# EasyEDA Pro project easy_eda_pro_file.epro

# Schematic Schematic1
Create Date: 2024-04-02; Page Name: P1; Project Name: modula_2024; Schematic Name: Schematic1; Update Date: 2024-04-03; Company: EasyEDA.com; Drawn: EasyEDA; Page Size: A4; Part Number: JLCPCB-002; Reviewed: EasyEDA; Version: V0.1
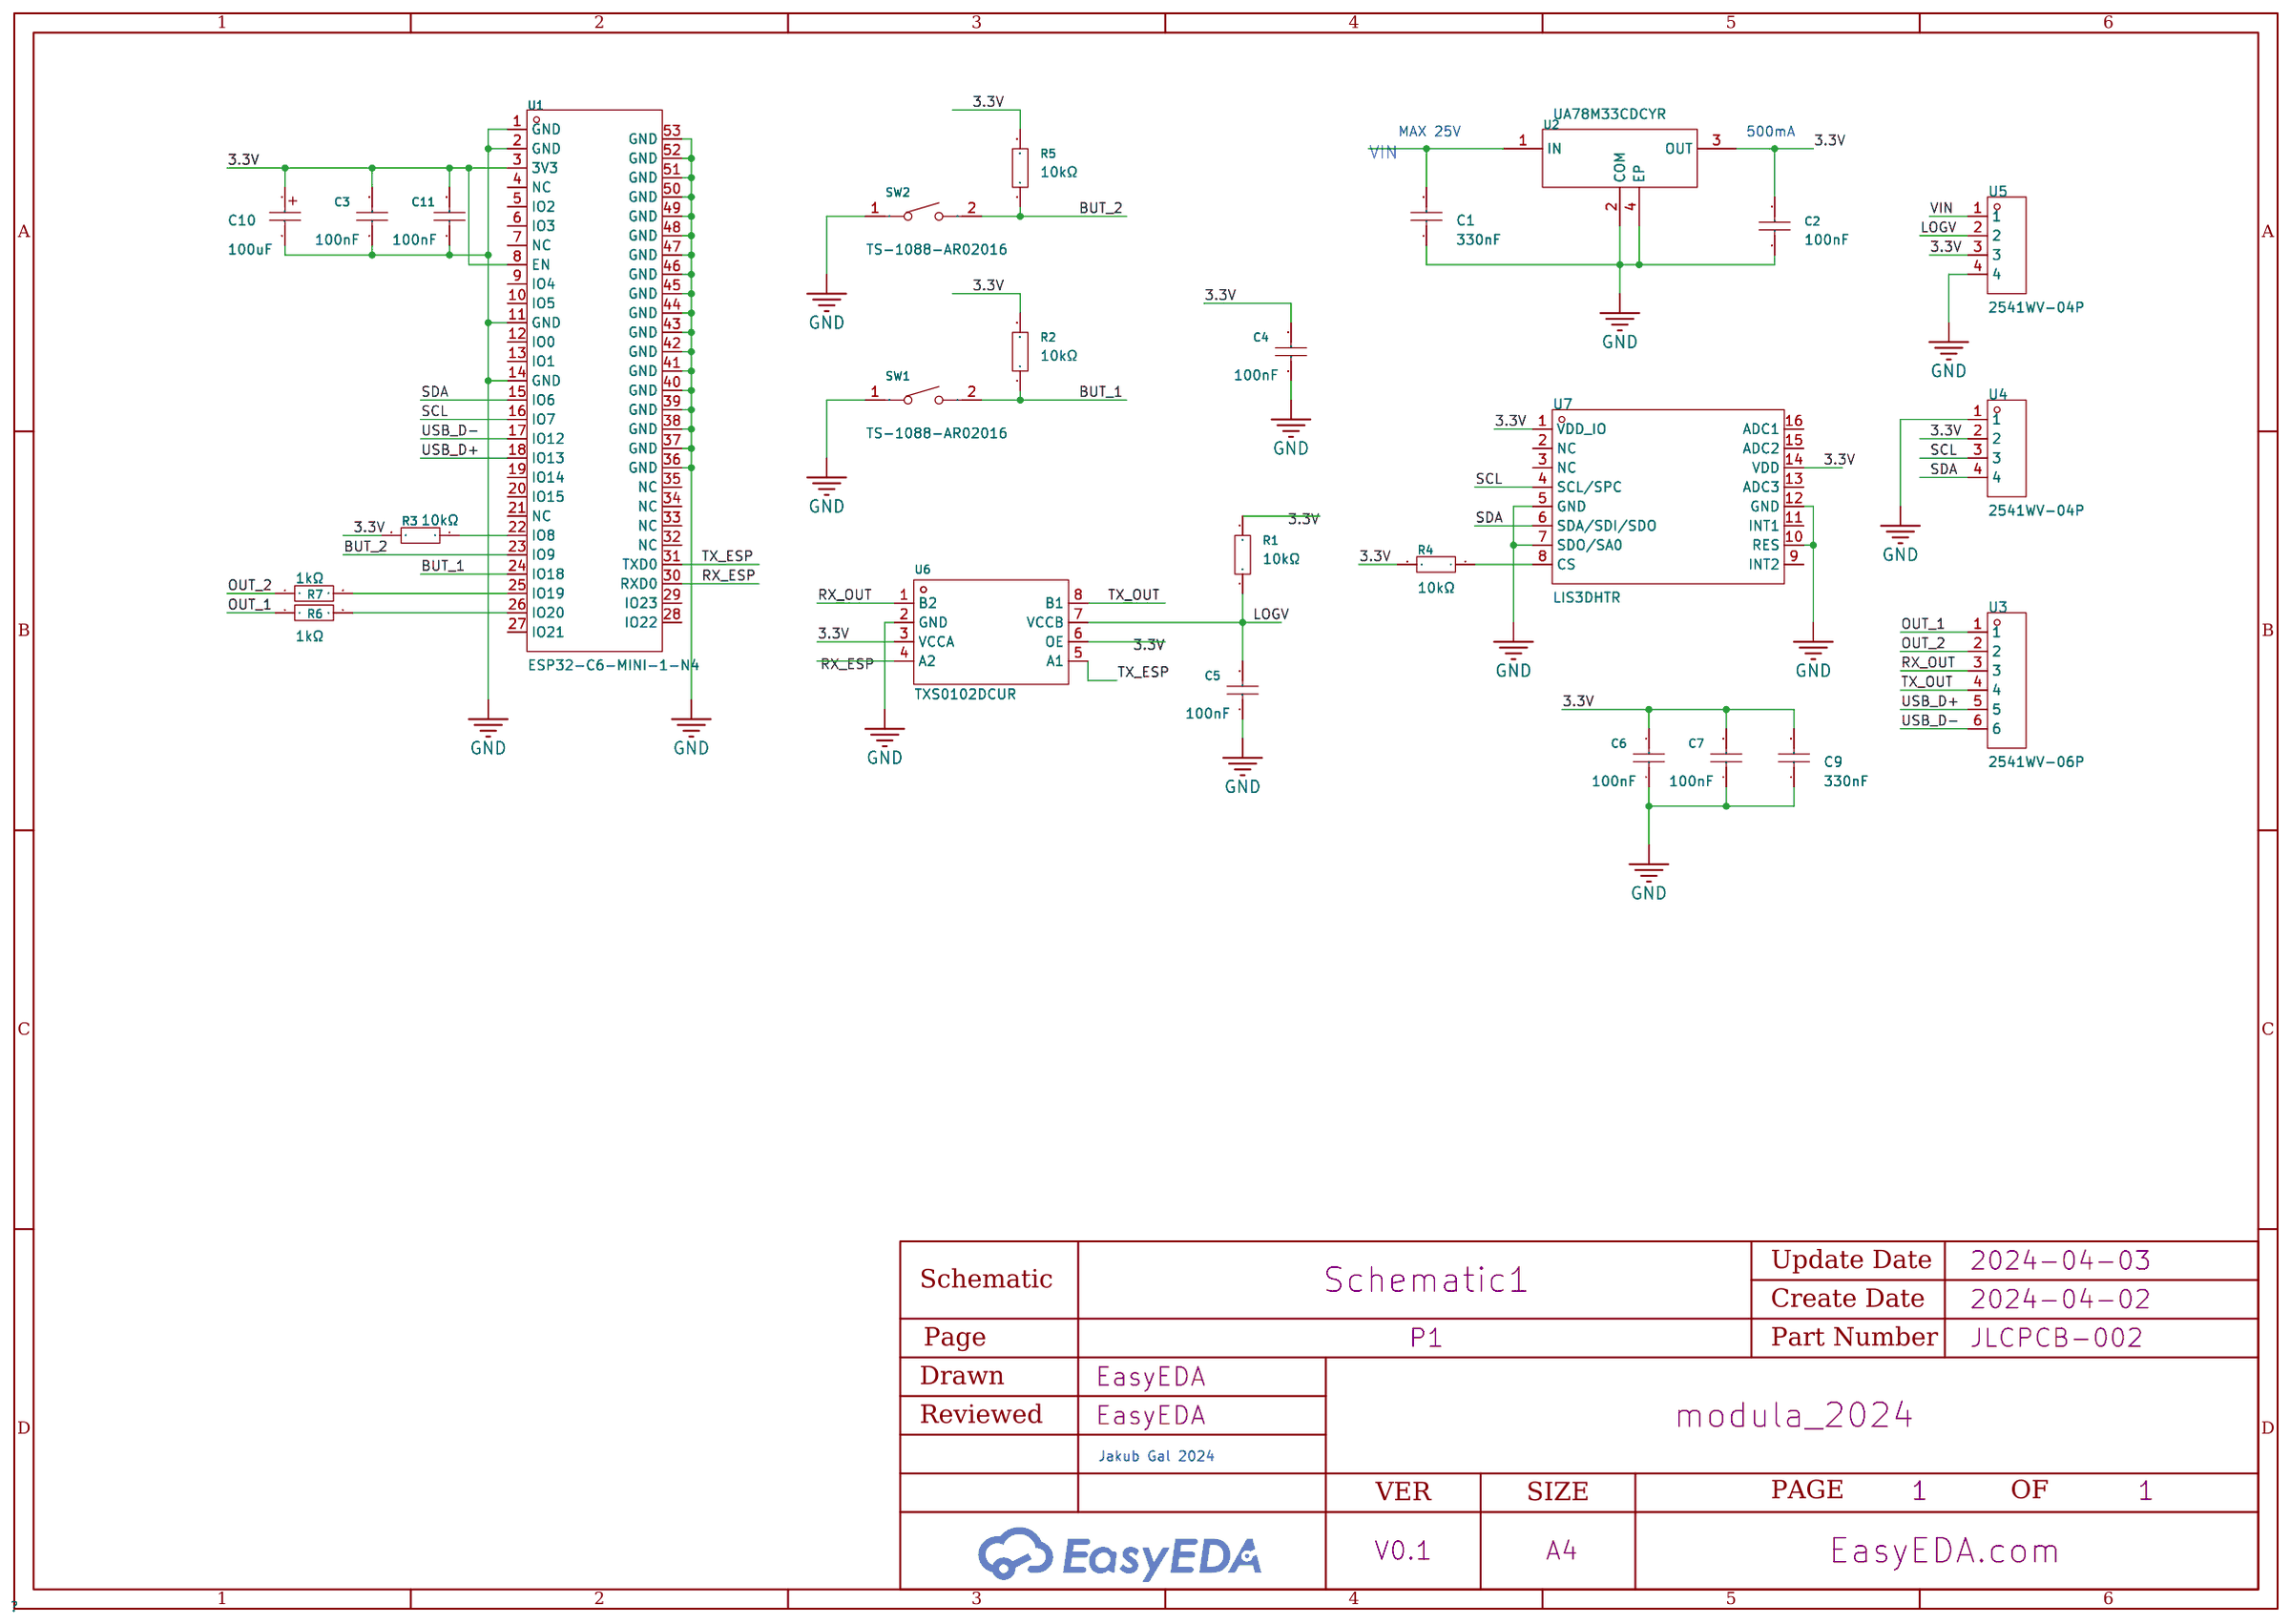
[diagram p0: schematic sheet]

## Parts
C1  330nF  [C0805]
C2  100nF  [C0603]
C3  100nF  [C0603]
C4  100nF  [C0603]
C5  100nF  [C0603]
C6  100nF  [C0603]
C7  100nF  [C0603]
C9  330nF  [C0805]
C10  100uF  [CAP-SMD_L3.5-W2.8-R-RD]
C11  100nF  [C0603]
R1  10kΩ  [R0603]
R2  10kΩ  [R0603]
R3  10kΩ  [R0603]
R4  10kΩ  [R0603]
R5  10kΩ  [R0603]
R6  1kΩ  [R0603]
R7  1kΩ  [R0603]
SW1  TS-1088-AR02016  [SW-SMD_L3.9-W3.0-P4.45]
SW2  TS-1088-AR02016  [SW-SMD_L3.9-W3.0-P4.45]
U1  ESP32-C6-MINI-1-N4  [WIFIM-SMD_61P-L16.6-W13.2-P0.80-ESP32-C6-MINI-1-N4]
U2  UA78M33CDCYR  [SOT-223_L6.5-W3.5-P2.30-LS7.0-BR]
U3  2541WV-06P  [HDR-TH_6P-P2.54-V-M]
U4  2541WV-04P  [HDR-TH_4P-P2.54-V-M-1]
U5  2541WV-04P  [HDR-TH_4P-P2.54-V-M-1]
U6  TXS0102DCUR  [VSON8_L2.0-W2.3-P0.50-LS3.1-BL]
U7  LIS3DHTR  [LGA-16_L3.0-W3.0-P0.50-TL]

## Library data of the parts
C1 C9 = 0805B334K500NT: Capacitance:330nF Tolerance:±10% Tolerance:±10% Voltage Rated: Temperature Coefficient:; LCSC Part Name: 330nF ±10% 50V; Supplier Part: C1740; Manufacturer: FH(风华); Supplier Footprint: 0805; JLCPCB Part Class: Extended Part; Datasheet: https://atta.szlcsc.com/upload/public/pdf/source/20200305/C486355_26A10D38EF8C2A5C37091D0039909270.pdf; Supplier: LCSC; Tolerance: ±10%
C2-C7 C11 = 0603B104K500NT_C30926: Capacitance:100nF Tolerance:±10% Tolerance:±10% Voltage Rated: Temperature Coefficient:; LCSC Part Name: 100nF ±10% 50V; Supplier Part: C30926; Manufacturer: FH(风华); Manufacturer Part: 0603B104K500NT; Supplier Footprint: 0603; JLCPCB Part Class: Extended Part; Datasheet: https://atta.szlcsc.com/upload/public/pdf/source/20200305/C486355_26A10D38EF8C2A5C37091D0039909270.pdf; Supplier: LCSC; Tolerance: ±10%
C10 = CA45-B-6.3V-100uF-K: Capacitance: Tolerance:±10% Tolerance:±10% Rated Voltage: Equivalent Series Resistance(ESR):5Ω@100kHz Operating Temperature:-55℃~+125℃ Operating Temperature:-55℃~+125℃; LCSC Part Name: 100uF ±10% 6.3V; Supplier Part: C129289; Manufacturer: CEC(振华新云); Supplier Footprint: CASE-B-3528; JLCPCB Part Class: Extended Part; Datasheet: https://atta.szlcsc.com/upload/public/pdf/source/20170914/C129289_1505359937328968145.pdf; Supplier: LCSC; Tolerance: ±10%; Equivalent Series Resistance(ESR): 5Ω@100kHz; Operating Temperature: -55℃~+125℃
R1-R5 = 0603WAF1002T5E: Type:Thick Film Resistors Resistance:10kΩ Tolerance:±1% Tolerance:±1% Power(Watts): Overload Voltage (Max): Temperature Coefficient:±100ppm/℃ Temperature Coefficient:±100ppm/℃ Operating Temperature Range:-55℃~+155℃ Operating Temperature Range:-55℃~+155℃; LCSC Part Name: 厚膜电阻 10kΩ ±1% 100mW; Supplier Part: C25804; Manufacturer: UNI-ROYAL(厚声); Supplier Footprint: 0603; JLCPCB Part Class: Basic Part; Datasheet: https://atta.szlcsc.com/upload/public/pdf/source/20200306/C422600_1E6D84923E4A46A82E41ADD87F860B5C.pdf; Supplier: LCSC; Type: Thick Film Resistors; Tolerance: ±1%; Temperature Coefficient: ±100ppm/℃; Operating Temperature Range: -55℃~+155℃
R6 R7 = 0603WAJ0102T5E: Type:Thick Film Resistors Resistance:1kΩ Tolerance:±5% Tolerance:±5% Power(Watts): Overload Voltage (Max): Temperature Coefficient:±100ppm/℃ Temperature Coefficient:±100ppm/℃ Operating Temperature Range:-55℃~+155℃ Operating Temperature Range:-55℃~+155℃; LCSC Part Name: 1kΩ ±5% 100mW 厚膜电阻; Supplier Part: C25585; Manufacturer: UNI-ROYAL(厚声); Supplier Footprint: 0603; JLCPCB Part Class: Extended Part; Datasheet: https://atta.szlcsc.com/upload/public/pdf/source/20200306/C422600_1E6D84923E4A46A82E41ADD87F860B5C.pdf; Supplier: LCSC; Type: Thick Film Resistors; Tolerance: ±5%; Temperature Coefficient: ±100ppm/℃; Operating Temperature Range: -55℃~+155℃
SW1 SW2 = TS-1088-AR02016: Circuit:SPST Actuator Style:Round Button Operating Force:160gf Mounting Style:Brick nogging Switch Length:4mm Switch Width:3mm Switch Height:2mm Strike Gundam:不带 Contact Current:50mA Voltage Rating (DC):12V Insulation Resistance:100MΩ Actuator/Cap Color:B; LCSC Part Name: 4*3*2mm 立贴 轻触开关; Supplier Part: C720477; Manufacturer: XUNPU(讯普); Supplier Footprint: SMD; JLCPCB Part Class: Extended Part; Datasheet: https://atta.szlcsc.com/upload/public/pdf/source/20200810/C720475_60D09DD6C54279ADDB2DC25100F1CC11.pdf; Supplier: LCSC; Circuit: SPST; Actuator Style: Round Button; Operating Force: 160gf; Mounting Style: Brick nogging; Switch Length: 4mm; Switch Width: 3mm; Switch Height: 2mm; Strike Gundam: 不带; Contact Current: 50mA; Voltage Rating (DC): 12V; Insulation Resistance: 100MΩ; Actuator/Cap Color: Black; Pin Style: SMDSplicing; Mechanical Life: 10万次; Operating Temperature: -30℃~+80℃
U1 = ESP32-C6-MINI-1-N4: Supplier Part: C5736265; Manufacturer: ESPRESSIF(乐鑫); Supplier Footprint: SMD-53P; JLCPCB Part Class: Extended Part; Datasheet: https://atta.szlcsc.com/upload/public/pdf/source/20240130/4529D418EFEC832950EB8101798FAED6.pdf; Supplier: LCSC
U2 = UA78M33CDCYR: Output Type: Maximum Input Voltage:25V Output Voltage:3.3V Output Voltage:3.3V MAX Output Current:500mA Power Supply Rejection Ratio (PSRR):80dB@(120Hz) Dropout Voltage:2V@(350mA) Operating Temperature:0℃~+125℃ Operating Temperature:0℃~+125℃ Output Polari; LCSC Part Name: 输入25V 输出3.3V 500mA; Supplier Part: C49036; Manufacturer: TI(德州仪器); Supplier Footprint: SOT-223; JLCPCB Part Class: Extended Part; Datasheet: https://www.ti.com/cn/lit/gpn/ua78m; Supplier: LCSC; Maximum Input Voltage: 25V; Output Voltage: 3.3V; MAX Output Current: 500mA; Power Supply Rejection Ratio (PSRR): 80dB@(120Hz); Dropout Voltage: 2V@(350mA); Operating Temperature: 0℃~+125℃; Output Polarity: Positive electrode; Number of Outputs: 1
U3 = 2541WV-06P: Pitch:2.54mm Mounting Type:Straight Number of Rows:Plugin Length of Mating Pin:6mm Insulation Height:2.54mm Length of End Connection Pin:3mm; Supplier Part: C5383115; Manufacturer: HanElectricity(瀚源); Supplier Footprint: 插件,P=2.54mm; JLCPCB Part Class: Extended Part; Datasheet: https://atta.szlcsc.com/upload/public/pdf/source/20230330/2BC52F76E32B2D45ECCE68ADA82449DD.pdf; Supplier: LCSC; Pitch: 2.54mm; Mounting Type: Straight; Number of Rows: Plugin; Length of Mating Pin: 6mm; Insulation Height: 2.54mm; Length of End Connection Pin: 3mm
U4 U5 = 2541WV-04P: Pitch:2.54mm Mounting Type:Straight Number of Rows:Plugin Length of Mating Pin:6mm Insulation Height:2.54mm Length of End Connection Pin:3mm; Supplier Part: C5383113; Manufacturer: HanElectricity(瀚源); Supplier Footprint: 插件,P=2.54mm; Datasheet: https://atta.szlcsc.com/upload/public/pdf/source/20230330/2BC52F76E32B2D45ECCE68ADA82449DD.pdf; Supplier: LCSC; Pitch: 2.54mm; Mounting Type: Straight; Number of Rows: Plugin; Length of Mating Pin: 6mm; Insulation Height: 2.54mm; Length of End Connection Pin: 3mm
U6 = TXS0102DCUR: Channel Type:Bi-Directional Input Signal:- Output Signal:- Data Rate:24Mbps Supply Voltage (VCCA):1.65V~3.6V Supply Voltage (VCCA):1.65V~3.6V Supply Voltage (VCCB):2.3V~5.5V Supply Voltage (VCCB):2.3V~5.5V Number of Circuits:1 Channels per Circuit:2 Outpu; LCSC Part Name: 24Mbps 2位双向电平转换器; Supplier Part: C53434; Manufacturer: TI(德州仪器); Supplier Footprint: VSSOP-8; JLCPCB Part Class: Extended Part; Datasheet: https://www.ti.com/cn/lit/gpn/txs0102; Supplier: LCSC; Channel Type: Bi-Directional; Data Rate: 24Mbps; Supply Voltage (VCCA): 1.65V~3.6V; Supply Voltage (VCCB): 2.3V~5.5V; Number of Circuits: 1; Channels per Circuit: 2; Output Type: Open Drain；Push-pull; Operating Temperature: -40℃~+85℃; Features: 自动方向检测
U7 = LIS3DHTR: Axial Direction:X,Y,Z Supply Voltage:1.71V~3.6V Supply Voltage:1.71V~3.6V Operating Temperature:-40℃~+85℃ Operating Temperature:-40℃~+85℃; Supplier Part: C15134; Manufacturer: ST(意法半导体); Supplier Footprint: LGA-16(3x3); JLCPCB Part Class: Extended Part; Datasheet: https://atta.szlcsc.com/upload/public/pdf/source/20170502/1493709336456.pdf; Supplier: LCSC; Axial Direction: X,Y,Z; Supply Voltage: 1.71V~3.6V; Operating Temperature: -40℃~+85℃

## Nets
3.3V: C2.2 C3.2 C4.2 C6.2 C7.2 C9.2 C10.1 C11.2 R1.2 R2.2 R3.2 R4.2 R5.2 U1.3(3V3) U1.8(EN) U2.3(OUT) U4.2 U5.3 U6.3(VCCA) U6.6(OE) U7.1(VDD_IO) U7.14(VDD)
GND: C1.1 C2.1 C3.1 C4.1 C5.1 C6.1 C7.1 C9.1 C10.2 C11.1 SW1.1 SW2.1 U1.1(GND) U1.2(GND) U1.11(GND) U1.14(GND) U1.36(GND) U1.37(GND) U1.38(GND) U1.39(GND) U1.40(GND) U1.41(GND) U1.42(GND) U1.43(GND) U1.44(GND) U1.45(GND) U1.46(GND) U1.47(GND) U1.48(GND) U1.49(GND) U1.50(GND) U1.51(GND) U1.52(GND) U1.53(GND) U2.2(COM) U2.4(EP) U4.1 U5.4 U6.2(GND) U7.5(GND) U7.7(SDO/SA0) U7.10(RES) U7.12(GND)
VIN: C1.2 U2.1(IN) U5.1
BUT_1: R2.1 SW1.2 U1.24(IO18)
BUT_2: R5.1 SW2.2 U1.23(IO9)
LOGV: C5.2 R1.1 U5.2 U6.7(VCCB)
OUT_1: R6.1 U3.1
OUT_2: R7.1 U3.2
RX_ESP: U1.30(RXD0) U6.4(A2)
RX_OUT: U3.3 U6.1(B2)
SCL: U1.16(IO7) U4.3 U7.4(SCL/SPC)
SDA: U1.15(IO6) U4.4 U7.6(SDA/SDI/SDO)
TX_ESP: U1.31(TXD0) U6.5(A1)
TX_OUT: U3.4 U6.8(B1)
USB_D+: U1.18(IO13) U3.5
USB_D-: U1.17(IO12) U3.6
$1N2460: R3.1 U1.22(IO8)
$1N2771: R4.1 U7.8(CS)
$1N3900: R7.2 U1.25(IO19)
$1N4216: R6.2 U1.26(IO20)

Not connected (* = marked no-connect by the designer): U1 4(NC) 5(IO2) 6(IO3) 7(NC) 9(IO4) 10(IO5) 12(IO0) 13(IO1) 19(IO14) 20(IO15) 21(NC) 27(IO21) 28(IO22) 29(IO23) 32(NC) 33(NC) 34(NC) 35(NC); U7 2(NC) 3(NC) 9(INT2) 11(INT1) 13(ADC3) 15(ADC2) 16(ADC1)

## Notes on the sheet
- MAX 25V
- 500mA
- Jakub Gal 2024

# Board PCB1
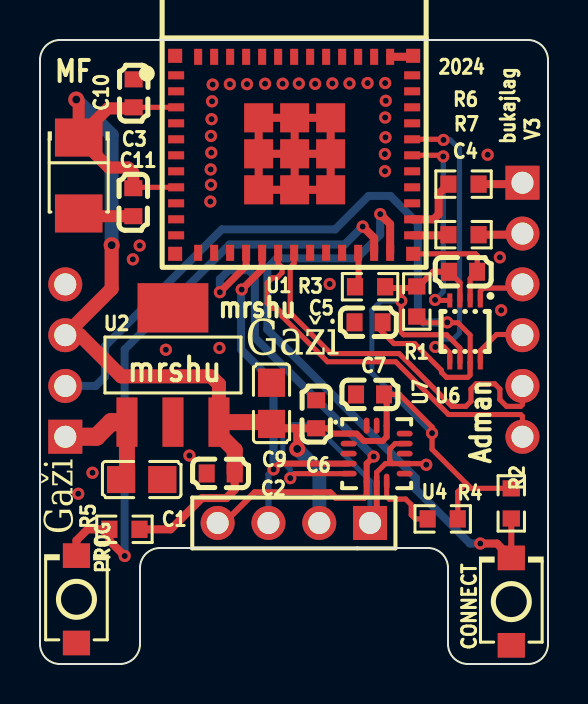
[diagram p1: board, top side]
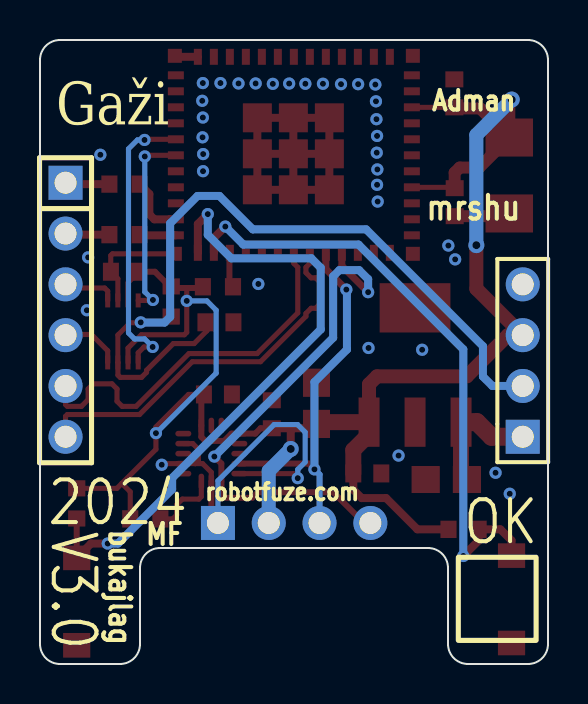
[diagram p2: board, bottom side, seen from below]

Outline 25.4 x 31.2 mm; copper layers: Top Layer, Bottom Layer. Coordinates in mm from the lower left corner of the outline.
Outline path: 0,30.2 0,1 arc(0.29,0.29) 1,0 4,0 arc(4.71,0.29) 5,1 5,4.8 arc(5.29,5.51) 6,5.8 19.4,5.8 arc(20.11,5.51) 20.4,4.8 20.4,1 arc(20.69,0.29) 21.4,0 24.4,0 arc(25.11,0.29) 25.4,1 25.4,30.2 arc(25.11,30.91) 24.4,31.2 1,31.2 arc(0.29,30.91) 0,30.2
Stack: Top Layer 0.035mm / Dielectric1 1.51mm FR4 er 4.5 / Bottom Layer 0.035mm

## Design rules (mm)
net USB_D-: DP1
net USB_D+: DP1
template: JLCPCB Capability(Two Layers Board)
spacing copperThickness1oz (default): track to track 0.102, other pairs 0.152 to 0.3
spacing copperThickness2oz: track to track 0.203, other pairs 0.152 to 0.3
track width copperThickness1oz (default): min 0.127, default 0.254, max 2.54
track width copperThickness2oz: min 0.203, default 0.254, max 2.54
differential pair differentialPair (default): width min 0.127, default 0.254, max 2.54; gap min 0.152, default 0.152
via viaSize (default): diameter min 0.5, default 0.61, max 10; hole min 0.3, default 0.305, max 6.3

## Placement (name value [footprint] x y rotation side)
C1  330nF  [C0805]  5.09 9.22 180 top
C2  100nF  [C0603]  9.04 9.53 0 top
C3  100nF  [C0603]  4.68 28.53 270 top
C4  100nF  [C0603]  21.15 19.61 180 top
C5  100nF  [C0603]  16.43 17.08 0 top
C6  100nF  [C0603]  13.81 12.49 270 top
C7  100nF  [C0603]  16.5 13.48 0 top
C9  330nF  [C0805]  11.58 13.03 270 top
C10  100uF  [CAP-SMD_L3.5-W2.8-R-RD]  1.94 24.43 90 top
C11  100nF  [C0603]  4.67 23.09 90 top
CONNECT  TS-1088-AR02016  [SW-SMD_L3.9-W3.0-P4.45]  23.57 3.12 90 top
PROG  TS-1088-AR02016  [SW-SMD_L3.9-W3.0-P4.45]  1.82 3.23 90 top
R1  10kΩ  [R0603]  18.84 18.13 90 top
R2  10kΩ  [R0603]  23.56 8.03 90 top
R3  10kΩ  [R0603]  16.5 18.86 0 top
R4  10kΩ  [R0603]  20.14 7.25 0 top
R5  10kΩ  [R0603]  4.22 6.73 0 top
R6  1kΩ  [R0603]  21.18 23.99 180 top
R7  1kΩ  [R0603]  21.18 21.47 180 top
U1  ESP32-C6-MINI-1-N4  [WIFIM-SMD_61P-L16.6-W13.2-P0.80-ESP32-C6-MINI-1-N4]  12.71 25.46 0 top
U2  UA78M33CDCYR  [SOT-223_L6.5-W3.5-P2.30-LS7.0-BR]  6.65 14.95 270 top
U3  2541WV-06P  [HDR-TH_6P-P2.54-V-M]  24.12 17.71 270 bottom
U4  2541WV-04P  [HDR-TH_4P-P2.54-V-M-1]  12.69 7.05 180 top
U5  2541WV-04P  [HDR-TH_4P-P2.54-V-M-1]  1.26 15.17 90 bottom
U6  TXS0102DCUR  [VSON8_L2.0-W2.3-P0.50-LS3.1-BL]  21.25 16.63 180 top
U7  LIS3DHTR  [LGA-16_L3.0-W3.0-P0.50-TL]  16.83 10.52 0 top

## Footprints (pads in the part's own frame, mm; a bottom-side part is the same pattern mirrored in y, then rotated)
C0603
  rect 0.8x0.9 smd: 1(-0.7,0) 2(0.7,0)
C0805
  rect 1.41x1.35 smd: 1(-1.03,0) 2(1.03,0)
CAP-SMD_L3.5-W2.8-R-RD
  rect 1.9x2.376 smd: 1(1.899,0) 2(-1.899,0)
HDR-TH_4P-P2.54-V-M-1
  rect 1.7x1.7 hole 1.1: 1(-3.81,0)
  round 1.7 hole 1.1: 2(-1.27,0) 3(1.27,0) 4(3.81,0)
HDR-TH_6P-P2.54-V-M
  rect 1.7x1.7 hole 1.1: 1(-6.35,0)
  round 1.7 hole 1.1: 2(-3.81,0) 3(-1.27,0) 4(1.27,0) 5(3.81,0) 6(6.35,0)
LGA-16_L3.0-W3.0-P0.50-TL
  oval 0.8x0.28 smd: 1(-1.4,1) 2(-1.4,0.5) 3(-1.4,0) 4(-1.4,-0.5) 5(-1.4,-1) 9(1.4,-1) 10(1.4,-0.5) 11(1.4,0) 12(1.4,0.5) 13(1.4,1)
  oval 0.28x0.8 smd: 6(-0.5,-1.4) 7(0,-1.4) 8(0.5,-1.4) 14(0.5,1.4) 15(0,1.4) 16(-0.5,1.4)
R0603
  rect 0.806x0.864 smd: 1(-0.753,0) 2(0.753,0)
SOT-223_L6.5-W3.5-P2.30-LS7.0-BR
  rect 2.465x1.05 smd: 1(2.857,-2.3) 2(2.857,0) 3(2.857,2.3)
  rect 2.465x3.54 smd: 4(-2.857,0)
SW-SMD_L3.9-W3.0-P4.45
  rect 1.23x1.36 smd: 1(-2.185,0) 2(2.185,0)
VSON8_L2.0-W2.3-P0.50-LS3.1-BL
  rect 0.25x0.7 smd: 1(-0.762,-1.55) 2(-0.254,-1.55) 3(0.254,-1.55) 4(0.762,-1.55) 5(0.762,1.55) 6(0.254,1.55) 7(-0.254,1.55) 8(-0.762,1.55)
WIFIM-SMD_61P-L16.6-W13.2-P0.80-ESP32-C6-MINI-1-N4
  rect 0.8x0.4 smd: 1(-5.9,3.975) 2(-5.9,3.175) 3(-5.9,2.375) 4(-5.9,1.575) 5(-5.9,0.775) 6(-5.9,-0.025) 7(-5.9,-0.825) 8(-5.9,-1.625) 9(-5.9,-2.425) 10(-5.9,-3.225) 11(-5.9,-4.025) 25(5.9,-4.025) 26(5.9,-3.225) 27(5.9,-2.425) 28(5.9,-1.625) 29(5.9,-0.825) 30(5.9,-0.025) 31(5.9,0.775) 32(5.9,1.575) 33(5.9,2.375) 34(5.9,3.175) 35(5.9,3.975)
  rect 0.4x0.8 smd: 12(-4.8,-4.9) 13(-4,-4.9) 14(-3.2,-4.9) 15(-2.4,-4.9) 16(-1.6,-4.9) 17(-0.8,-4.9) 18(0,-4.9) 19(0.8,-4.9) 20(1.6,-4.9) 21(2.4,-4.9) 22(3.2,-4.9) 23(4,-4.9) 24(4.8,-4.9) 36(4.8,4.9) 37(4,4.9) 38(3.2,4.9) 39(2.4,4.9) 40(1.6,4.9) 41(0.8,4.9) 42(0,4.9) 43(-0.8,4.9) 44(-1.6,4.9) 45(-2.4,4.9) 46(-3.2,4.9) 47(-4,4.9) 48(-4.8,4.9)
  rect 1.45x1.45 smd: 49(-1.775,1.85) 49(-1.775,0.05) 49(-1.775,-1.75) 49(0.025,1.85) 49(0.025,0.05) 49(0.025,-1.75) 49(1.825,1.85) 49(1.825,0.05) 49(1.825,-1.75)
  rect 0.7x0.7 smd: 50(5.95,4.95) 51(5.95,-4.95) 52(-5.95,-4.95) 53(-5.95,4.95)

## Nets
As in the schematic, except:
GND: C1.1 C2.1 C3.1 C4.1 C5.1 C6.1 C7.1 C9.1 C10.2 C11.1 CONNECT.1 PROG.1 U1.1 U1.2 U1.11 U1.14 U1.36 U1.37 U1.38 U1.39 U1.40 U1.41 U1.42 U1.43 U1.44 U1.45 U1.46 U1.47 U1.48 U1.49 U1.50 U1.51 U1.52 U1.53 U2.2 U2.4 U4.1 U5.4 U6.2 U7.5 U7.7 U7.10 U7.12
BUT_1: CONNECT.2 R2.1 U1.24
BUT_2: PROG.2 R5.1 U1.23

Pads without a net: U1 4 5 6 7 9 10 12 13 19 20 21 27 28 29 32 33 34 35; U7 2 3 9 11 13 15 16

## Via types
v1: diameter 0.61, hole 0.305, Top Layer to Bottom Layer, 51 vias
v2: diameter 0.8, hole 0.4, Top Layer to Bottom Layer, 3 vias

## Routing (per net, layer and track width the routed paths; a pad name or vN(x,y) marks a point on that pad's centre or on a via; arc(x,y) is an arc through that point)
3.3V: length 94.7
  Top Layer w0.254: U1.8 4.71,23.83 C11.2 ; U1.3 4.8,27.83 4.74,27.78
  Top Layer w0.256: C7.2 17.98,13.48 19.6,11.85 v1(19.6,11.54) 19.6,10.73 21.31,9.03 ; R2.2 21.55,8.78 21.31,9.03 ; U6.6 21,15.8 20.33,16.46 18.18,16.46 18.06,16.58 v1(18.06,18.16) 18.06,18.77 18.1,18.8 ; R4.2 20.89,8.61 21.31,9.03 ; 20.45,19.61 21,19.07 U6.3
  Top Layer w0.3: C7.2 17.33,13.35 U7.14 17.33,11.35 17.13,11.15 16.19,11.15 15.83,11.52 U7.1 14.64,11.52 14.37,11.79 C6.2 ; 20.45,19.61 19.65,19.61 18.84,18.8 17.43,18.8
  Top Layer w0.4: v2(12.86,10.75) 12.86,11.66 12.73,11.79 ; 12.73,11.79 11.79,11.79 C9.2 ; 12.73,11.79 C6.2 ; C2.2 9.74,8.72 9.32,8.3 8.1,8.3 6.53,6.73 R5.2
  Top Layer w0.6: C10.1 3.44,24.82 4.41,24.82 4.67,24.57 C11.2 ; C10.1 1.94,28.1 v2(1.81,28.22) ; C10.1 3.39,27.78 4.74,27.78
  Top Layer w0.7: U2.3 8.95,13.99 8.55,14.38 4.06,14.38 2,16.44 U5.3 3.58,18.76 v2(3.58,20.94)
  Top Layer w0.8: C2.2 9.74,10.7 8.95,11.48 U2.3 11.49,12.09 C9.2
  Bottom Layer w0.256: 19.59,11.54 16.59,14.54 16.59,17.69 17.06,18.16 v1(18.06,18.16)
  Bottom Layer w0.7: U4.2 13.96,9.65 v2(12.86,10.75) ; v2(3.58,20.94) 3.58,26.45 v2(1.81,28.22)
GND: length 51.5
  Top Layer w0.256: 17.64,10.02 17.27,10.02 16.83,9.58 U7.7 ; 17.64,10.02 17.48,10.17 17.48,10.74 17.76,11.02 U7.12 ; 17.64,10.02 U7.10 19.26,10.02 v1(19.31,9.96) ; U1.51 21.78,20.51 21.86,20.42 21.86,19.62 21.51,19.26 U6.2 ; v1(12.51,9.29) 12.74,9.52 U7.5
  Top Layer w0.3: U4.1 16.83,7.38 U7.7
  Top Layer w0.4: U1.49 U1.49 ; U1.49 U1.49 ; U1.49 U1.49 ; U1.49 U1.49 ; U1.49 U1.49 U1.49 ; U1.49 U1.49 U1.49 ; U1.50 18.61,30.36 U1.36 ; U1.49 U1.49 U1.49 ; U1.49 U1.49 U1.49
  Top Layer w0.6: C11.1 2.07,22.39 C10.2
  Bottom Layer w0.256: U4.1 16.5,9.16 13.69,11.97 12.52,11.97 12.14,11.59 12.14,10.1 12.51,9.73 v1(12.51,9.29)
  vias: v1(1.91,8.51) v1(2.62,9.56) v1(4.64,20.23) v1(4.98,20.92) v1(6.29,15.71) v1(7.47,10.42) v1(8.53,24.73) v1(8.52,23.12) v1(8.63,28.97) v1(8.6,28.13) v1(8.58,27.24) v1(8.55,26.4) v1(8.56,25.57) v1(8.55,23.96) v1(8.97,15.8) v1(9.49,28.99) v1(10.35,28.99) v1(11.25,29.01) v1(12.13,29.01) v1(12.94,29.02) v1(13.76,29.01) v1(14.48,19) v1(14.62,29.03) v1(15.48,29.03) v1(16.38,29.05) v1(17.24,25.5) v1(17.26,29.05) v1(17.29,28.16) v1(17.26,27.32) v1(17.27,26.33) v1(17.25,24.64) v1(22.38,25.46) v1(22.99,20.33) v1(23.06,17.69)
VIN: length 6.4
  Top Layer w0.8: C1.2 4.35,9.52 U2.1
  Top Layer w0.9: U2.1 3.55,12.09 2.82,11.36 U5.1
BUT_1: length 31.8
  Top Layer w0.3: CONNECT.2 23.57,7.27
  Top Layer w0.4: v1(22.02,6.02) 22.85,6.02 CONNECT.2 ; v1(17.01,22.49) 17.51,22 U1.24
  Bottom Layer w0.4: v1(22.02,6.02) 21.5,6.02 18.79,8.73 18.79,9.3 11.36,16.73 11.36,19.81 11.83,20.28 15.83,20.28 17.01,21.46 v1(17.01,22.49)
BUT_2: length 30.6
  Top Layer w0.4: v1(16.13,21.87) 16.71,21.3 U1.23 ; PROG.2 1.82,6.18 2.38,6.73 R5.1 3.47,6.17 v1(4.24,5.4)
  Bottom Layer w0.4: v1(16.13,21.87) 15.23,20.97 9.47,20.97 4.24,15.73 v1(4.24,5.4)
LOGV: length 40.3
  Top Layer w0.25: R1.1 19.15,17.06 20.89,17.06 21.51,16.45 U6.7
  Top Layer w0.256: C5.2 17.06,16.66 17.69,16.02 18.74,16.02 20.07,14.68 20.07,14.58 20.32,14.33 21.39,14.33 21.5,14.44 21.5,15.07 U6.7
  Bottom Layer w0.4: v1(20.36,17.08) 20.35,17.07 19.17,17.07 18.89,17.35 18.89,22.03 17.52,23.4 16.43,23.4 14.76,21.73 9.09,21.73 3.25,15.89 3.25,14.37 2.78,13.9 U5.2
OUT_1: length 1.9
  Top Layer w0.4: 23.77,24.1 23.67,23.99 R6.1
OUT_2: length 1.9
  Top Layer w0.4: R7.1 23.68,21.47 23.77,21.56
RX_ESP: length 9.7
  Top Layer w0.256: U6.4 19.78,18.18 v1(19.75,18.2) ; v1(20.16,25.38) 20.1,25.43 U1.30
  Bottom Layer w0.256: v1(20.16,25.38) 20.16,18.61 v1(19.75,18.2)
RX_OUT: length 2.4
  Top Layer w0.256: 23.77,19.02 23.55,18.8 22.17,18.8 22.02,18.65 U6.1
SCL: length 18.6
  Top Layer w0.3: U7.4 11.96,10.02 v1(11.68,9.73)
  Top Layer w0.35: v1(10.08,18.72) 11.11,19.75 U1.16
  Bottom Layer w0.3: U4.3 11.42,9.48 v1(11.68,9.73)
  Bottom Layer w0.4: v1(10.08,18.72) 10.05,18.69 10.05,15.72 11.68,14.1 v1(11.68,9.73)
SDA: length 27
  Top Layer w0.3: U4.4 9.2,7.05 10.74,8.59 14.51,8.59 14.79,8.31 16.21,8.31 16.33,8.43 U7.6 16.33,10.02 v1(16.68,10.37)
  Top Layer w0.35: v1(8.99,18.59) 10.31,19.91 U1.15
  Bottom Layer w0.4: v1(16.68,10.37) 10.74,16.31 10.74,19.38 10.43,19.69 9.44,19.69 8.99,19.24 v1(8.99,18.59)
TX_ESP: length 14.6
  Top Layer w0.256: v1(20.17,26.2) 20.14,26.23 U1.31 ; v1(19.77,15.85) 20.2,15.85 20.49,15.56 U6.5
  Bottom Layer w0.256: v1(20.17,26.2) 20.53,26.2 20.98,25.76 20.98,16.55 20.67,16.25 20.17,16.25 v1(19.77,15.85)
TX_OUT: length 2.7
  Top Layer w0.256: 23.77,16.48 22.83,16.48 22.02,15.66 U6.8
USB_D+: length 19.2
  Top Layer w0.256: U1.18 12.71,20.03 12.51,19.84 12.51,17.55 14.54,15.52 17.95,15.52 20.59,12.88 21.29,12.88 21.55,13.14 21.55,13.75 21.81,14.01 22.74,14.01 22.99,13.75 22.99,13.22 23.33,12.88 24.03,12.88 24.12,12.97 U3.5
USB_D-: length 19.2
  Top Layer w0.256: U3.6 24.12,12.38 24.03,12.47 20.42,12.47 17.78,15.11 14.37,15.11 12.1,17.38 12.1,17.53 11.85,17.78 11.62,17.78 11.36,18.04 11.36,19.05 11.62,19.31 11.85,19.31 12.1,19.56 12.1,19.84 11.91,20.03 U1.17
$1N2460: length 1.8
  Top Layer w0.3: 15.93,18.8 15.93,20.54 U1.22
$1N2771: length 3.6
  Top Layer w0.256: R4.1 18.76,7.25 18.56,7.46 18.56,7.97 18.28,8.25 17.46,8.25 17.33,8.37 U7.8
$1N3900: length 1.8
  Top Layer w0.4: U1.25 20.39,21.43 R7.2
$1N4216: length 3.1
  Top Layer w0.4: R6.2 19.93,23.5 19.93,22.48 19.68,22.23 U1.26

## Copper pours and planes (outline as drawn; the poured copper is in the pictures)
GND on Top Layer: -0.74,32.09 26.26,32.09 26.26,0.09 -0.74,0.09
GND on Bottom Layer: -0.74,32.17 26.26,32.17 26.26,0.17 -0.74,0.17

## Text on the board
Bottom Silkscreen Layer: robotfuze.com | Adman | MF | bukajlag | mrshu | OK | 2024 | V3.0 | Gaži
Top Silkscreen Layer: 2024 | bukajlag | V3 | Adman | mrshu | MF | Gaži
